# Altium schematic sheet USB_Audio.SchDoc
size A; DrawnBy: KEW; Revision: X1; SheetNumber: 5; SheetTotal: 10; RevisionDate: 9/6/2024; RevisionDescription: First Rev; RevisionEngineer: KEW; ProjectTitle: Front USB-Audio; CompanyName: Gamber-Johnson LLC; Organization: CD Cell; Application_BuildNumber: TBD
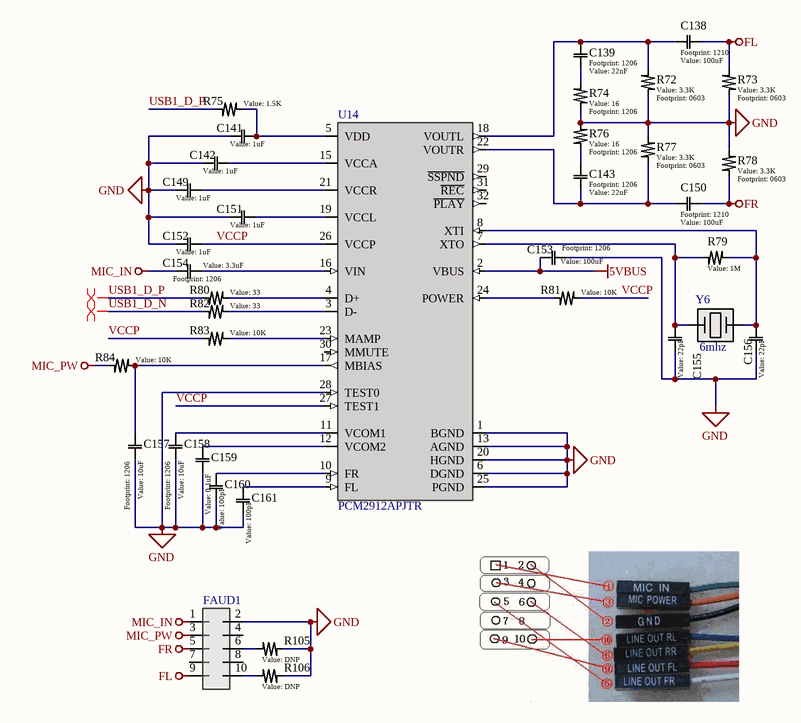
[diagram p0: USB_Audio.SchDoc]

## Parts
C138  value 100uF  [1210]  (hidden comment: Generic Capacitor)
C139  value 22nF  [1206]  (hidden comment: Generic Capacitor)
C141  value 1uF  [0603]  (hidden comment: Generic Capacitor)
C142  value 1uF  [0603]  (hidden comment: Generic Capacitor)
C143  value 22nF  [1206]  (hidden comment: Generic Capacitor)
C149  value 1uF  [0603]  (hidden comment: Generic Capacitor)
C150  value 100uF  [1210]  (hidden comment: Generic Capacitor)
C151  value 1uF  [0603]  (hidden comment: Generic Capacitor)
C152  value 1uF  [0603]  (hidden comment: Generic Capacitor)
C153  value 100uF  [1206]  (hidden comment: Generic Capacitor)
C154  value 3.3uF  [1206]  (hidden comment: Generic Capacitor)
C155  value 22pF  [0603]  (hidden comment: Generic Capacitor)
C156  value 22pF  [0603]  (hidden comment: Generic Capacitor)
C157  value 10uF  [1206]  (hidden comment: Generic Capacitor)
C158  value 10uF  [1206]  (hidden comment: Generic Capacitor)
C159  value 0.1uF  [0603]  (hidden comment: Generic Capacitor)
C160  value 100pF  [0603]  (hidden comment: Generic Capacitor)
C161  value 100pF  [0603]  (hidden comment: Generic Capacitor)
FAUD1  10pinMobo  [10pinMobo]  (value not drawn)
R72  value 3.3K  [0603]  (hidden comment: Generic Resistor)
R73  value 3.3K  [0603]  (hidden comment: Generic Resistor)
R74  value 16  [1206]  (hidden comment: Generic Resistor)
R75  value 1.5K  [0603]  (hidden comment: Generic Resistor)
R76  value 16  [1206]  (hidden comment: Generic Resistor)
R77  value 3.3K  [0603]  (hidden comment: Generic Resistor)
R78  value 3.3K  [0603]  (hidden comment: Generic Resistor)
R79  value 1M  [0603]  (hidden comment: Generic Resistor)
R80  value 33  [0603]  (hidden comment: Generic Resistor)
R81  value 10K  [0603]  (hidden comment: Generic Resistor)
R82  value 33  [0603]  (hidden comment: Generic Resistor)
R83  value 10K  [0603]  (hidden comment: Generic Resistor)
R84  value 10K  [0603]  (hidden comment: Generic Resistor)
R105  value DNP  [0603]  (hidden comment: Generic Resistor)
R106  value DNP  [0603]  (hidden comment: Generic Resistor)
U14  PCM2912APJTR  [32-TQFP]
Y6  6mhz  [HC-49S-SMD]

## Nets
5VBUS: C153.1 U14.2(VBUS)
FL: C138.1 FAUD1.9 R73.2
FR: C150.1 FAUD1.5 R78.2
GND: C141.1 C142.1 C149.1 C151.1 C152.1 C153.2 C155.2 C156.2 C157.2 C158.2 C159.2 C160.2 C161.2 FAUD1.2 R72.1 R73.1 R74.1 R76.1 R77.1 R78.1 R105.1 R106.1 U14.1(BGND) U14.6(DGND) U14.13(AGND) U14.20(HGND) U14.25(PGND) U14.28(TEST0)
MIC_IN: C154.2 FAUD1.1
MIC_PW: FAUD1.3 R84.2
USB1_D_N: R82.2
USB1_D_P: R75.2 R80.2
VCCP: C152.2 R81.1 R83.2 U14.26(VCCP) U14.27(TEST1)
NetC138_2: C138.2 C139.1 R72.2 U14.18(VOUTL)
NetC139_2: C139.2 R74.2
NetC141_2: C141.2 R75.1 U14.5(VDD)
NetC142_2: C142.2 U14.15(VCCA)
NetC143_1: C143.1 C150.2 R77.2 U14.22(VOUTR)
NetC143_2: C143.2 R76.2
NetC149_2: C149.2 U14.21(VCCR)
NetC151_2: C151.2 U14.19(VCCL)
NetC154_1: C154.1 U14.16(VIN)
NetC155_1: C155.1 R79.1 U14.7(XTO) Y6.1
NetC156_1: C156.1 R79.2 U14.8(XTI) Y6.2
NetC157_1: C157.1 R84.1 U14.17(MBIAS)
NetC158_1: C158.1 U14.11(VCOM1)
NetC159_1: C159.1 U14.12(VCOM2)
NetC160_1: C160.1 U14.10(FR)
NetC161_1: C161.1 U14.9(FL)
NetFAUD1_6: FAUD1.6 R105.2
NetFAUD1_10: FAUD1.10 R106.2
NetR80_1: R80.1 U14.4(D+)
NetR81_2: R81.2 U14.24(POWER)
NetR82_1: R82.1 U14.3(D-)
NetR83_1: R83.1 U14.23(MAMP)

Not connected (* = marked no-connect by the designer): FAUD1 4 7 8; U14 29(~{SSPND}) 30(MMUTE) 31(~{REC}) 32(~{PLAY})

## Layout directives
differential pair: USB1_D_N, USB1_D_P

## Notes on the sheet
- REV
- REVISIONS
- DATE
- DESCRIPTION
- BY
- UNLESS OTHERWISE SPECIFIED, DRAWING DEFINITIONS AND TOLERANCES SHALL BE FOUND UNDER SUPPLIER STANDARDS SS-001. THIS PART AND ALL COMPONENTS OF IT MUST BE RoHS & REACH COMPLIANT. A CERTIFICATE OF COMPLIANCE MUST BE PROVIDED UPON REQUEST.
- ALL INFORMATION ON THIS DOCUMENT IS THE SOLE PROPERTY OF GAMBER-JOHNSON AND SHALL NOT BE COPIED, REPRODUCED, USED OR DISCLOSED IN WHOLE OR IN PART WITHOUT THE WRITTEN CONSENT OF GAMBER-JOHNSON
- TOLERANCES
  .00 ± .060
  .000 ± .020
  .0000 ± .005
  ANGELS ± 1°
- DRAWN BY:
- PROJECT NUMBER:
- SHEET TITLE:
- SHEET
- OF
- DATE:
- LOCATION:
- ASSEMBLY NUMBER
- SIZE
- GAMBER-JOHNSON LLC
  5001 Joerns Dr
  STEVENS POINT, WI 54481
  +1 (715) 344-5209
- A

## Library data of the parts
C138 C139 C141-C143 C149-C161 = Generic Capacitor: Voltage: >10V; Tolerance: 10%
FAUD1 = 10pinMobo: 10pin motherboard jack
R72-R84 R105 R106 = Generic Resistor: Tolerance: 1%; Power: 1/10W
U14 = PCM2912APJTR: Audio CODEC with USB Interface, Mono Microphone Input and Stereo Headphone Output 32-TQFP -25 to 85; MF: Texas Instruments; MP: PCM2912APJTR; Price: None; DigiKey-Purchase-URL: https://snapeda.com/shop?store=DigiKey&id=574055; Package: TQFP-32 Texas Instruments; Texas_Instruments-Purchase-URL: https://snapeda.com/shop?store=Texas+Instruments&id=574055; Value: *; Availability: Unavailable; Mouser-Purchase-URL: https://snapeda.com/shop?store=Mouser&id=574055; SnapEDA_Link: https://www.snapeda.com/parts/PCM2912APJTR/Texas%20Instruments/view-part/574055/?ref=snap; LCSC PN: C475497
Y6 = H6OEL89CSC-SUGYLC-6M: 6MHz Surface Mount Crystal 20pF ±20ppm ±30ppm HC-49S-SMD Crystals; LCSC PN: C7528811